# EAGLE design Controle_16_reles V3 (EAGLE 4.09)
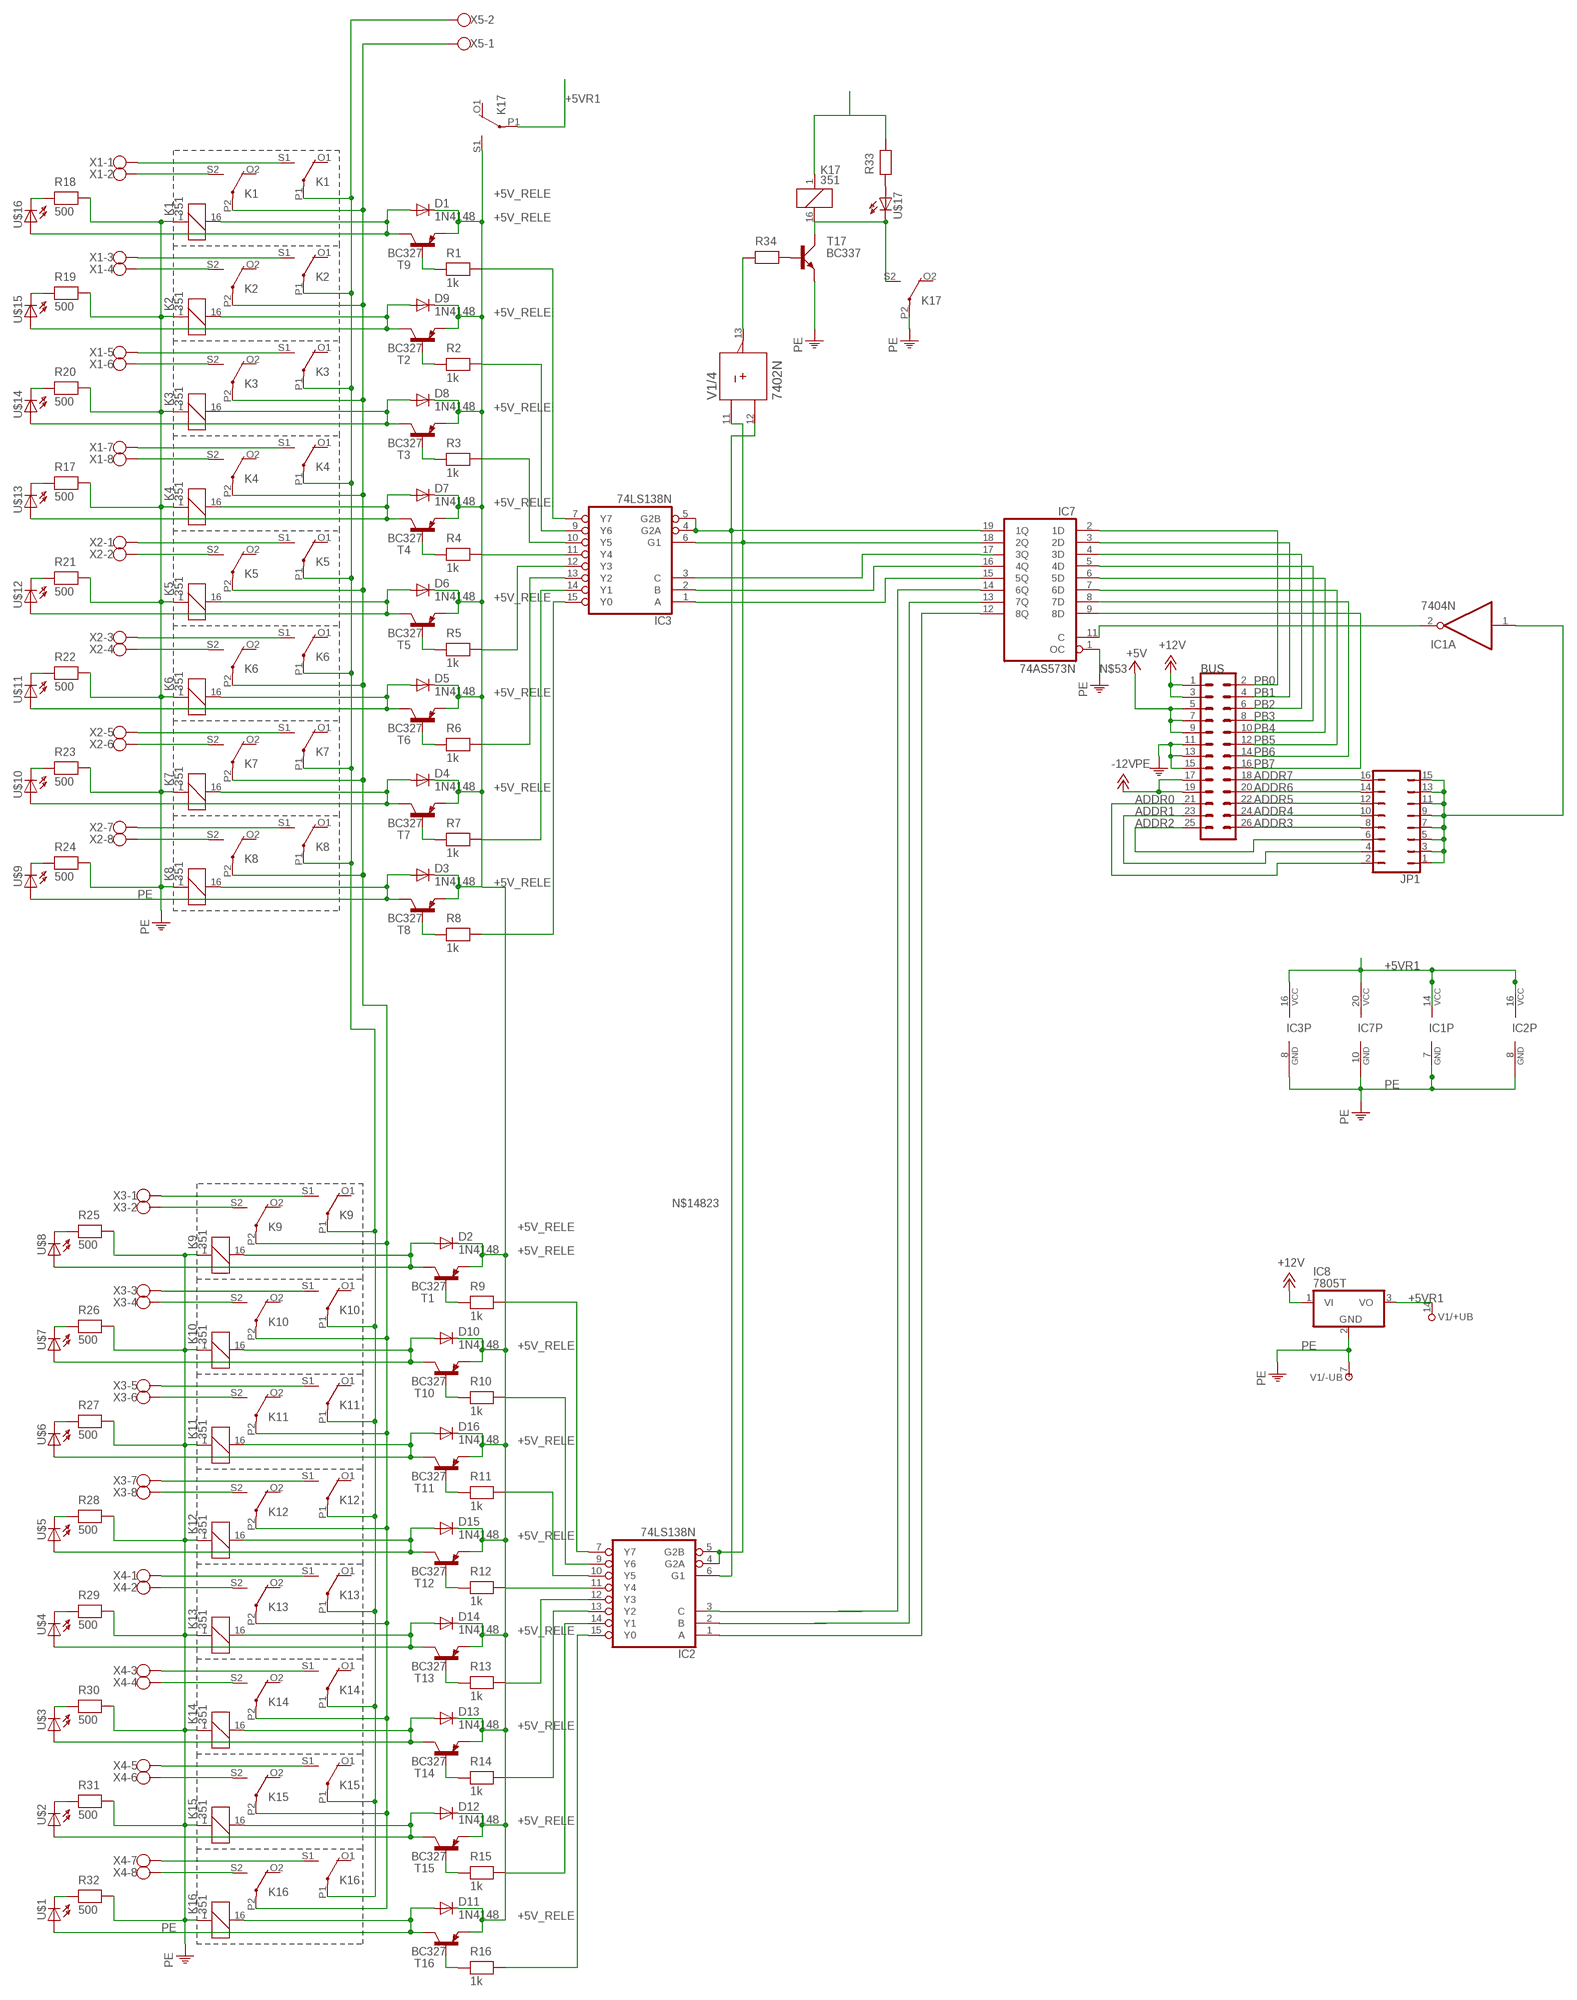
[diagram p0: schematic, sheet 1]

## Parts
BUS  ML26  [ML26]
D1  1N4148  [DO35-10]
D2  1N4148  [DO35-10]
D3  1N4148  [DO35-10]
D4  1N4148  [DO35-10]
D5  1N4148  [DO35-10]
D6  1N4148  [DO35-10]
D7  1N4148  [DO35-10]
D8  1N4148  [DO35-10]
D9  1N4148  [DO35-10]
D10  1N4148  [DO35-10]
D11  1N4148  [DO35-10]
D12  1N4148  [DO35-10]
D13  1N4148  [DO35-10]
D14  1N4148  [DO35-10]
D15  1N4148  [DO35-10]
D16  1N4148  [DO35-10]
IC1  7404N  [DIL14]
IC2  74LS138N  [DIL16]
IC3  74LS138N  [DIL16]
IC7  74AS573N  [DIL20]
IC8  7805T  [TO220H]
JP1  JP8Q  [JP8Q]
K1  351  [351]
K2  351  [351]
K3  351  [351]
K4  351  [351]
K5  351  [351]
K6  351  [351]
K7  351  [351]
K8  351  [351]
K9  351  [351]
K10  351  [351]
K11  351  [351]
K12  351  [351]
K13  351  [351]
K14  351  [351]
K15  351  [351]
K16  351  [351]
K17  351  [351]
R1  1k  RESEU-10  [R-10]
R2  1k  RESEU-10  [R-10]
R3  1k  RESEU-10  [R-10]
R4  1k  RESEU-10  [R-10]
R5  1k  RESEU-10  [R-10]
R6  1k  RESEU-10  [R-10]
R7  1k  RESEU-10  [R-10]
R8  1k  RESEU-10  [R-10]
R9  1k  RESEU-10  [R-10]
R10  1k  RESEU-10  [R-10]
R11  1k  RESEU-10  [R-10]
R12  1k  RESEU-10  [R-10]
R13  1k  RESEU-10  [R-10]
R14  1k  RESEU-10  [R-10]
R15  1k  RESEU-10  [R-10]
R16  1k  RESEU-10  [R-10]
R17  500  RESEU-10  [R-10]
R18  500  RESEU-10  [R-10]
R19  500  RESEU-10  [R-10]
R20  500  RESEU-10  [R-10]
R21  500  RESEU-10  [R-10]
R22  500  RESEU-10  [R-10]
R23  500  RESEU-10  [R-10]
R24  500  RESEU-10  [R-10]
R25  500  RESEU-10  [R-10]
R26  500  RESEU-10  [R-10]
R27  500  RESEU-10  [R-10]
R28  500  RESEU-10  [R-10]
R29  500  RESEU-10  [R-10]
R30  500  RESEU-10  [R-10]
R31  500  RESEU-10  [R-10]
R32  500  RESEU-10  [R-10]
R33  RESEU-10  [R-10]
R34  RESEU-10  [R-10]
T1  BC327  [TO92]
T2  BC327  [TO92]
T3  BC327  [TO92]
T4  BC327  [TO92]
T5  BC327  [TO92]
T6  BC327  [TO92]
T7  BC327  [TO92]
T8  BC327  [TO92]
T9  BC327  [TO92]
T10  BC327  [TO92]
T11  BC327  [TO92]
T12  BC327  [TO92]
T13  BC327  [TO92]
T14  BC327  [TO92]
T15  BC327  [TO92]
T16  BC327  [TO92]
T17  BC337  [SOT54A]
U$1  LED3MM  [LED3MM]
U$2  LED3MM  [LED3MM]
U$3  LED3MM  [LED3MM]
U$4  LED3MM  [LED3MM]
U$5  LED3MM  [LED3MM]
U$6  LED3MM  [LED3MM]
U$7  LED3MM  [LED3MM]
U$8  LED3MM  [LED3MM]
U$9  LED3MM  [LED3MM]
U$10  LED3MM  [LED3MM]
U$11  LED3MM  [LED3MM]
U$12  LED3MM  [LED3MM]
U$13  LED3MM  [LED3MM]
U$14  LED3MM  [LED3MM]
U$15  LED3MM  [LED3MM]
U$16  LED3MM  [LED3MM]
U$17  LED3MM  [LED3MM]
V1  7402N  [DIL14]
X1  AK500/8  [AK500/8]
X2  AK500/8  [AK500/8]
X3  AK500/8  [AK500/8]
X4  AK500/8  [AK500/8]
X5  AK300/2  [AK300/2]

## Nets
+5V: BUS.5 BUS.7 BUS.9
+5V_RELE: D1.C D2.C D3.C D4.C D5.C D6.C D7.C D8.C D9.C D10.C D11.C D12.C D13.C D14.C D15.C D16.C K17.S1(2:S) T1.1(E) T2.1(E) T3.1(E) T4.1(E) T5.1(E) T6.1(E) T7.1(E) T8.1(E) T9.1(E) T10.1(E) T11.1(E) T12.1(E) T13.1(E) T14.1(E) T15.1(E) T16.1(E)
+5VR1: IC1.14(P:VCC) IC2.16(VCC) IC3.16(VCC) IC7.20(VCC) IC8.3(VO) K17.P1(2:P) V1.14(/+UB:+UB)
+12V: BUS.1 BUS.3 IC8.1(VI)
-12V: BUS.17 BUS.19
ADDR0: BUS.21 JP1.2
ADDR1: BUS.23 JP1.4
ADDR2: BUS.25 JP1.6
ADDR3: BUS.26 JP1.8
ADDR4: BUS.24 JP1.10
ADDR5: BUS.22 JP1.12
ADDR6: BUS.20 JP1.14
ADDR7: BUS.18 JP1.16
GARANTIA1: IC2.6(G1) IC3.4(G2A) IC3.5(G2B) IC7.19(1Q) V1.12(/4:B)
GARANTIA2: IC2.4(G2A) IC2.5(G2B) IC3.6(G1) IC7.18(2Q) V1.11(/4:A)
N$1: R9.1 T1.2(B)
N$2: R5.1 T5.2(B)
N$3: IC3.7(Y7) R1.2
N$4: IC3.9(Y6) R2.2
N$5: IC3.10(Y5) R3.2
N$6: IC3.11(Y4) R4.2
N$7: IC3.15(Y0) R8.2
N$8: IC3.14(Y1) R7.2
N$9: IC3.13(Y2) R6.2
N$10: R1.1 T9.2(B)
N$11: IC3.3(C) IC7.17(3Q)
N$12: IC3.2(B) IC7.16(4Q)
N$13: R34.2 T17.B
N$15: D6.A K5.16 T5.3(C) U$12.A
N$16: K17.16 K17.S2(3:S) T17.C U$17.K(C)
N$17: R2.1 T2.2(B)
N$18: D1.A K1.16 T9.3(C) U$16.A
N$19: D9.A K2.16 T2.3(C) U$15.A
N$20: R6.1 T6.2(B)
N$21: R3.1 T3.2(B)
N$22: D8.A K3.16 T3.3(C) U$14.A
N$23: D5.A K6.16 T6.3(C) U$11.A
N$24: R4.1 T4.2(B)
N$25: D7.A K4.16 T4.3(C) U$13.A
N$26: R7.1 T7.2(B)
N$27: D4.A K7.16 T7.3(C) U$10.A
N$28: R8.1 T8.2(B)
N$29: D3.A K8.16 T8.3(C) U$9.A
N$30: IC3.12(Y3) R5.2
N$32: R34.1 V1.13(/4:Y)
N$33: IC1.1(A:I) JP1.1 JP1.3 JP1.5 JP1.7 JP1.9 JP1.11 JP1.13 JP1.15
N$34: IC3.1(A) IC7.15(5Q)
N$35: K1.S1(2:S) X1.1
N$36: K1.S2(3:S) X1.2
N$37: K2.S1(2:S) X1.3
N$38: K2.S2(3:S) X1.4
N$39: K3.S1(2:S) X1.5
N$40: K3.S2(3:S) X1.6
N$41: K4.S1(2:S) X1.7
N$42: K4.S2(3:S) X1.8
N$43: K5.S1(2:S) X2.1
N$44: K5.S2(3:S) X2.2
N$45: K6.S1(2:S) X2.3
N$46: K6.S2(3:S) X2.4
N$47: K7.S1(2:S) X2.5
N$48: K7.S2(3:S) X2.6
N$49: K8.S1(2:S) X2.7
N$50: K8.S2(3:S) X2.8
N$51: R18.1 U$16.K(C)
N$52: D2.A K9.16 T1.3(C) U$8.A
N$53: IC1.2(A:O) IC7.11(C)
N$54: R10.1 T10.2(B)
N$55: D10.A K10.16 T10.3(C) U$7.A
N$56: R11.1 T11.2(B)
N$57: D16.A K11.16 T11.3(C) U$6.A
N$58: R12.1 T12.2(B)
N$60: D15.A K12.16 T12.3(C) U$5.A
N$61: R13.1 T13.2(B)
N$62: D14.A K13.16 T13.3(C) U$4.A
N$63: R14.1 T14.2(B)
N$64: D13.A K14.16 T14.3(C) U$3.A
N$65: R15.1 T15.2(B)
N$66: D12.A K15.16 T15.3(C) U$2.A
N$67: R16.1 T16.2(B)
N$68: D11.A K16.16 T16.3(C) U$1.A
N$69: IC2.7(Y7) R9.2
N$70: IC2.9(Y6) R10.2
N$71: IC2.10(Y5) R11.2
N$72: IC2.11(Y4) R12.2
N$73: IC2.15(Y0) R16.2
N$74: IC2.14(Y1) R15.2
N$75: IC2.13(Y2) R14.2
N$76: IC2.12(Y3) R13.2
N$77: IC2.2(B) IC7.13(7Q)
N$78: K9.S1(2:S) X3.1
N$79: K9.S2(3:S) X3.2
N$80: K10.S1(2:S) X3.3
N$81: K10.S2(3:S) X3.4
N$82: K11.S1(2:S) X3.5
N$83: K11.S2(3:S) X3.6
N$84: K12.S1(2:S) X3.7
N$85: K12.S2(3:S) X3.8
N$86: K13.S1(2:S) X4.1
N$87: K13.S2(3:S) X4.2
N$88: K14.S1(2:S) X4.3
N$89: K14.S2(3:S) X4.4
N$90: K15.S1(2:S) X4.5
N$91: K15.S2(3:S) X4.6
N$92: K16.S1(2:S) X4.7
N$93: K16.S2(3:S) X4.8
N$94: R20.1 U$14.K(C)
N$95: R19.1 U$15.K(C)
N$96: R32.1 U$1.K(C)
N$98: R17.1 U$13.K(C)
N$108: K17.1 R33.2
N$112: R33.1 U$17.A
N$114: IC2.3(C) IC7.14(6Q)
N$118: IC2.1(A) IC7.12(8Q)
N$148: K1.P1(2:P) K2.P1(2:P) K3.P1(2:P) K4.P1(2:P) K5.P1(2:P) K6.P1(2:P) K7.P1(2:P) K8.P1(2:P) K9.P1(2:P) K10.P1(2:P) K11.P1(2:P) K12.P1(2:P) K13.P1(2:P) K14.P1(2:P) K15.P1(2:P) K16.P1(2:P) X5.2
N$150: R21.1 U$12.K(C)
N$153: R22.1 U$11.K(C)
N$156: R23.1 U$10.K(C)
N$160: R24.1 U$9.K(C)
N$163: R25.1 U$8.K(C)
N$165: R26.1 U$7.K(C)
N$169: R27.1 U$6.K(C)
N$171: R28.1 U$5.K(C)
N$174: R29.1 U$4.K(C)
N$177: R30.1 U$3.K(C)
N$180: R31.1 U$2.K(C)
N$14823: K1.P2(3:P) K2.P2(3:P) K3.P2(3:P) K4.P2(3:P) K5.P2(3:P) K6.P2(3:P) K7.P2(3:P) K8.P2(3:P) K9.P2(3:P) K10.P2(3:P) K11.P2(3:P) K12.P2(3:P) K13.P2(3:P) K14.P2(3:P) K15.P2(3:P) K16.P2(3:P) X5.1
PB0: BUS.2 IC7.2(1D)
PB1: BUS.4 IC7.3(2D)
PB2: BUS.6 IC7.4(3D)
PB3: BUS.8 IC7.5(4D)
PB4: BUS.10 IC7.6(5D)
PB5: BUS.12 IC7.7(6D)
PB6: BUS.14 IC7.8(7D)
PB7: BUS.16 IC7.9(8D)
PE: BUS.11 BUS.13 BUS.15 IC1.7(P:GND) IC2.8(GND) IC3.8(GND) IC7.1(OC) IC7.10(GND) IC8.2(GND) K1.1 K2.1 K3.1 K4.1 K5.1 K6.1 K7.1 K8.1 K9.1 K10.1 K11.1 K12.1 K13.1 K14.1 K15.1 K16.1 K17.P2(3:P) R17.2 R18.2 R19.2 R20.2 R21.2 R22.2 R23.2 R24.2 R25.2 R26.2 R27.2 R28.2 R29.2 R30.2 R31.2 R32.2 T17.E V1.7(/-UB:-UB)
Unconnected: IC1.3(B:I) IC1.4(B:O) IC1.5(C:I) IC1.6(C:O) IC1.8(D:O) IC1.9(D:I) IC1.10(E:O) IC1.11(E:I) IC1.12(F:O) IC1.13(F:I) K1.O1(2:O) K1.O2(3:O) K2.O1(2:O) K2.O2(3:O) K3.O1(2:O) K3.O2(3:O) K4.O1(2:O) K4.O2(3:O) K5.O1(2:O) K5.O2(3:O) K6.O1(2:O) K6.O2(3:O) K7.O1(2:O) K7.O2(3:O) K8.O1(2:O) K8.O2(3:O) K9.O1(2:O) K9.O2(3:O) K10.O1(2:O) K10.O2(3:O) K11.O1(2:O) K11.O2(3:O) K12.O1(2:O) K12.O2(3:O) K13.O1(2:O) K13.O2(3:O) K14.O1(2:O) K14.O2(3:O) K15.O1(2:O) K15.O2(3:O) K16.O1(2:O) K16.O2(3:O) K17.O1(2:O) K17.O2(3:O) V1.1(/1:Y) V1.2(/1:A) V1.3(/1:B) V1.4(/2:Y) V1.5(/2:A) V1.6(/2:B) V1.8(/3:A) V1.9(/3:B) V1.10(/3:Y)

## Library data of the parts
BUS = con-harting-ml:ML26: HARTING
D1-D16 = diode:1N4148: DIODE high speed (Philips)
IC1 = 74xx-us:74*04: Hex INVERTER
IC2 IC3 = 74xx-us:74*138: 3-line to 8-line DECODER/DEMULTIPLEXER
IC7 = 74xx-us:74*573: 8-bit D latch BUS DRIVER
IC8 = linear:78*: Positive VOLTAGE REGULATOR
JP1 = jumper:JP8Q: JUMPER
K1-K17 = relay:351: RELAY 2 x switch, Omron
R1-R34 = discrete:RESEU-10
T1-T16 = transistor-pnp:BC327: PNP Transistor
T17 = transistor-small-signal:BC337: NPN TRANSISTOR
U$1-U$17 = led:LED: LED
V1 = 74ttl-din:74*02: Quad 2-input NOR gate
X1-X4 = con-ptr500:AK500/8: CONNECTOR
X5 = con-ptr500:AK300/2: CONNECTOR

## Board
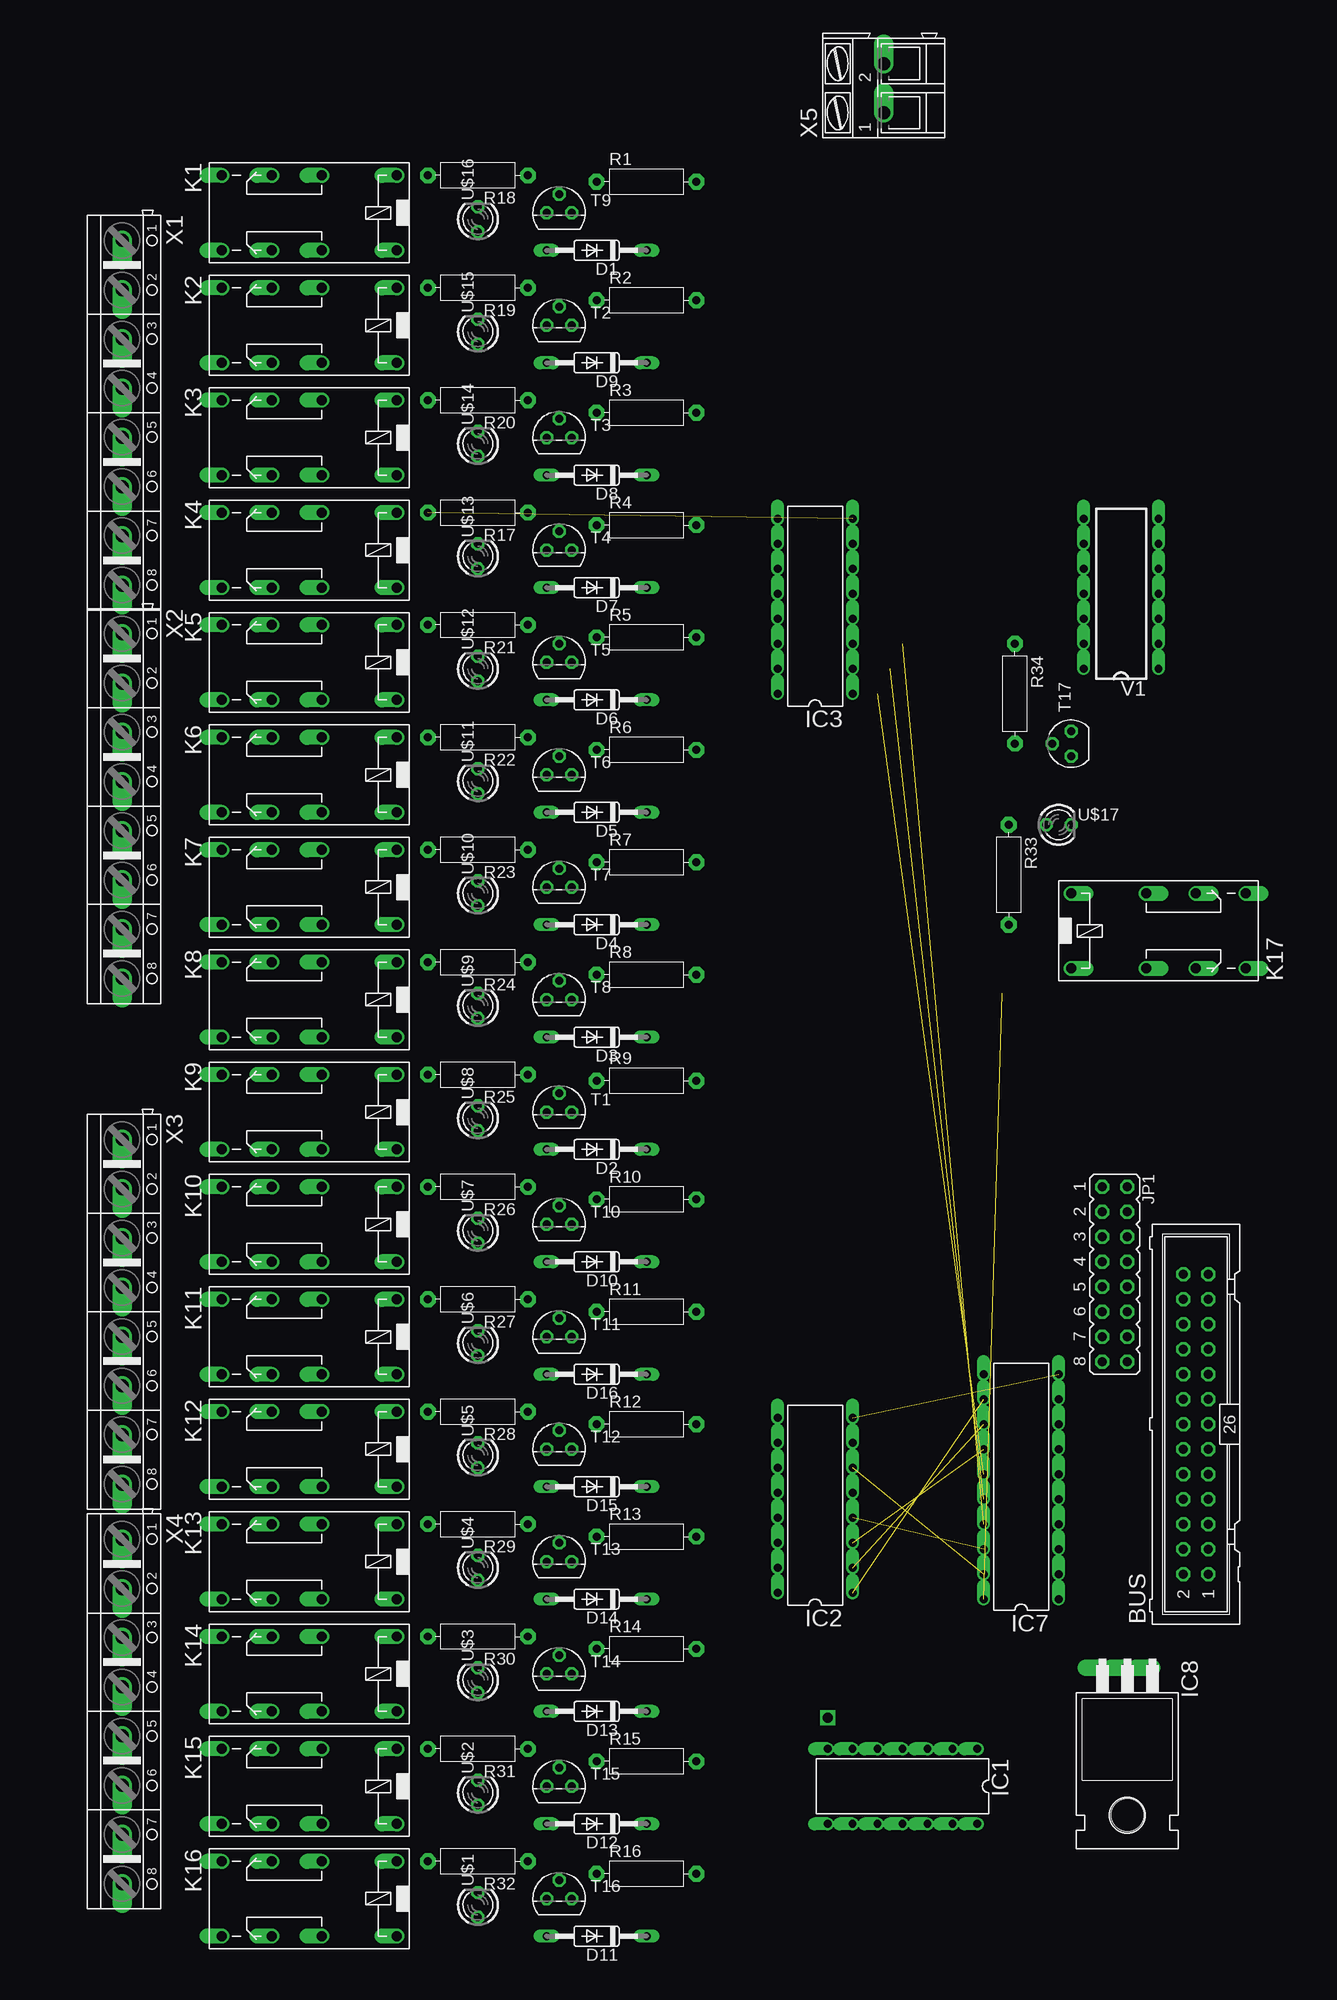
[diagram p1: board, top side]
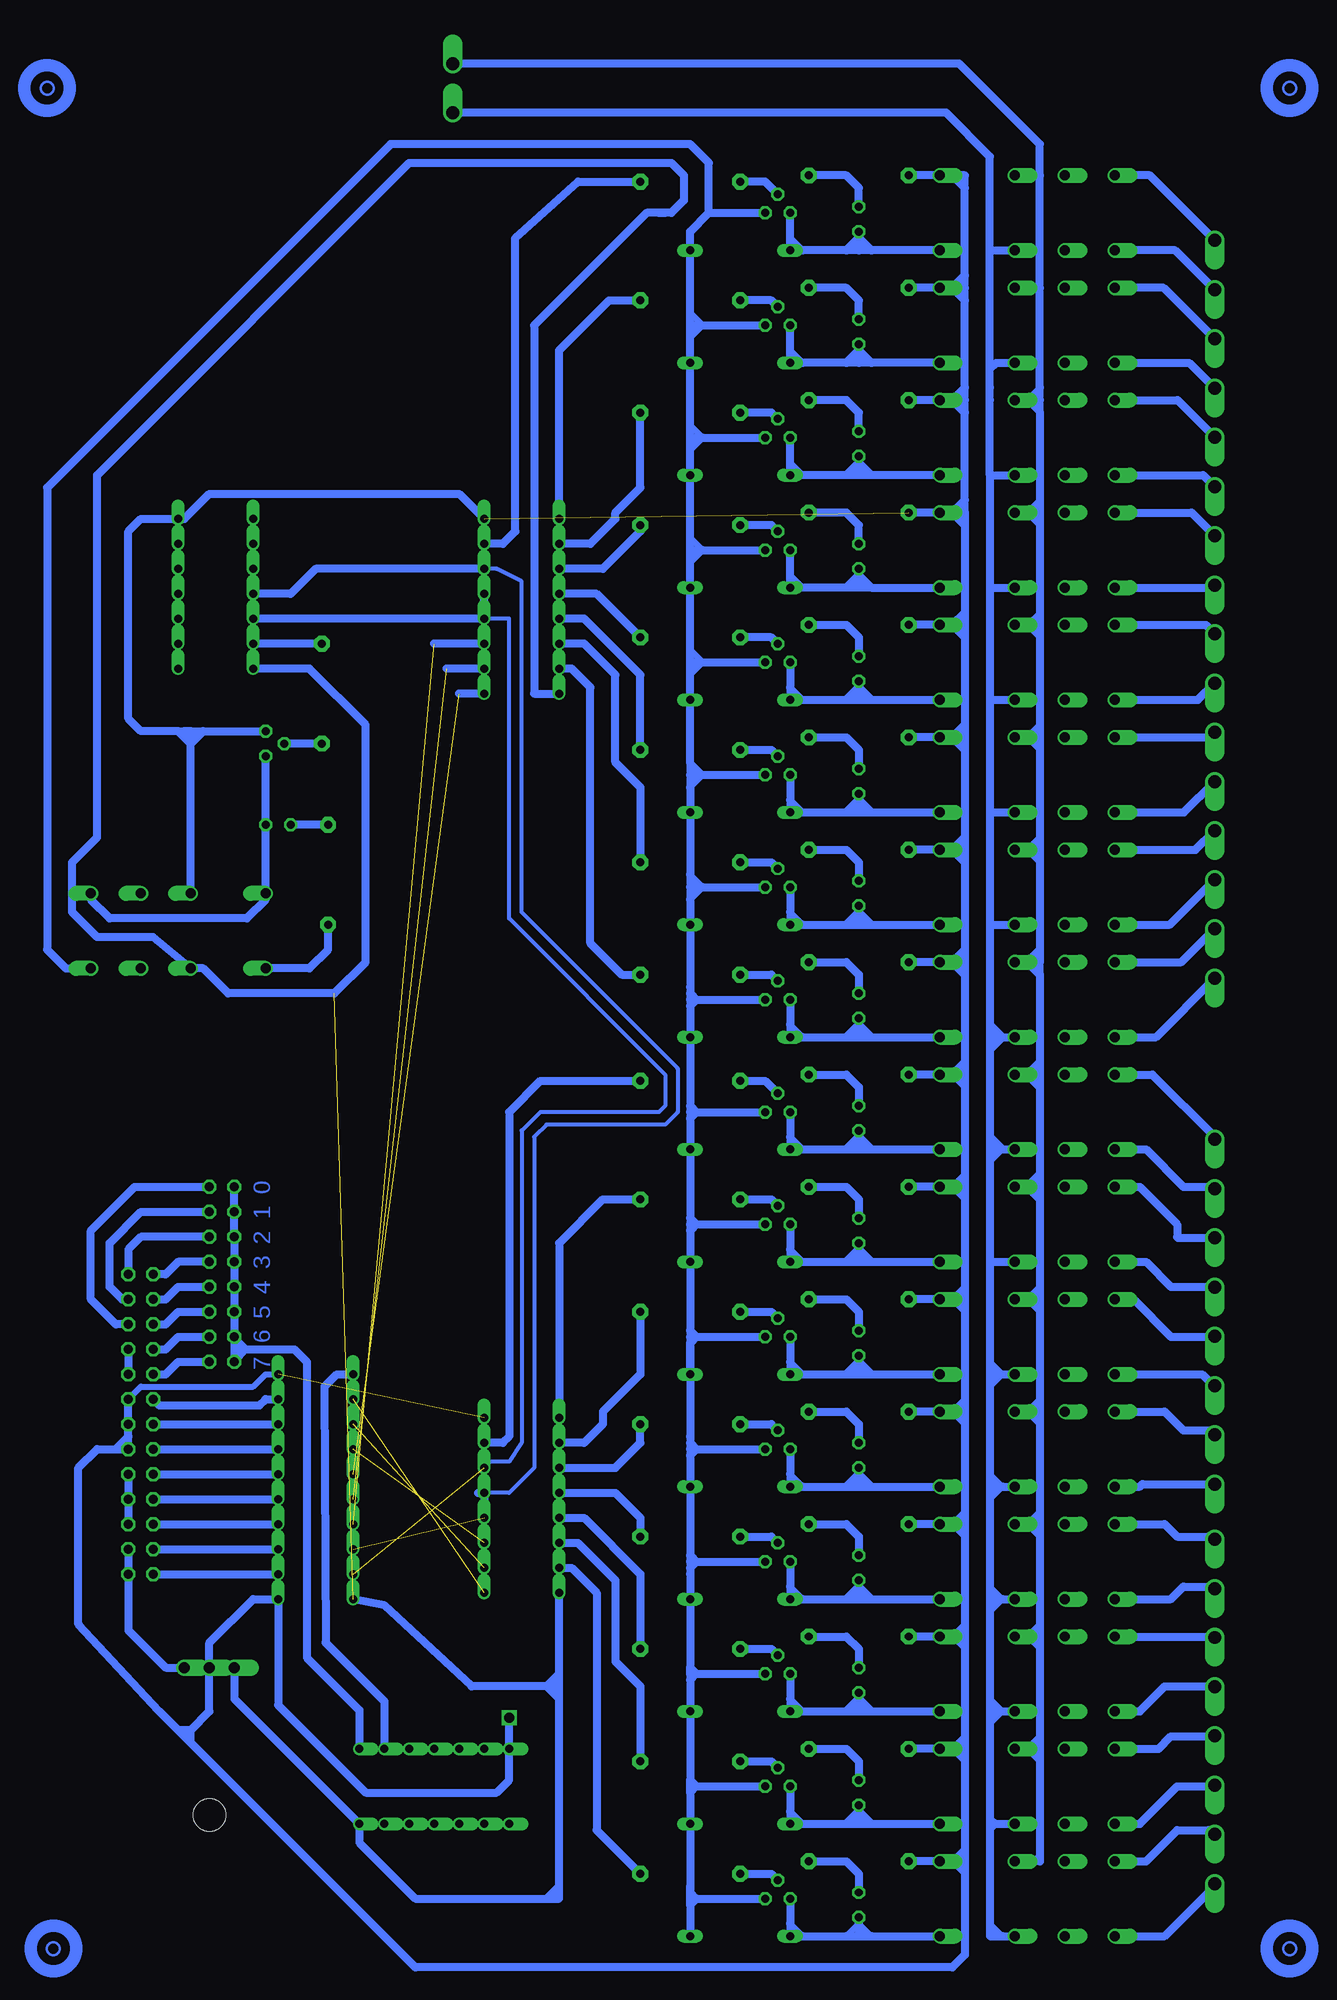
[diagram p2: board, bottom side, seen from below]

No outline drawn. Coordinates in mm, seen from the top.
Copper layers used: Bottom

### Footprints (pad centres in the part's own frame; a part is rotated, then mirrored left to right if it is on the bottom)
ML26 = drill 0.914 octagon: 1 -15.24,-1.27; 2 -15.24,1.27; 3 -12.7,-1.27; 4 -12.7,1.27; 5 -10.16,-1.27; 6 -10.16,1.27; 7 -7.62,-1.27; 8 -7.62,1.27; 9 -5.08,-1.27; 10 -5.08,1.27; 11 -2.54,-1.27; 12 -2.54,1.27; 13 0,-1.27; 14 0,1.27; 15 2.54,-1.27; 16 2.54,1.27; 17 5.08,-1.27; 18 5.08,1.27; 19 7.62,-1.27; 20 7.62,1.27; 21 10.16,-1.27; 22 10.16,1.27; 23 12.7,-1.27; 24 12.7,1.27; 25 15.24,-1.27; 26 15.24,1.27
DO35-10 = drill 0.813 long: A 5.08,0; C -5.08,0
DIL14 = drill 0.8 offset: 1 -7.62,-3.81; 2 -5.08,-3.81; 3 -2.54,-3.81; 4 0,-3.81; 5 2.54,-3.81; 6 5.08,-3.81; 7 7.62,-3.81; 8 7.62,3.81; 9 5.08,3.81; 10 2.54,3.81; 11 0,3.81; 12 -2.54,3.81; 13 -5.08,3.81; 14 -7.62,3.81
DIL16 = drill 0.813 offset: 1 -8.89,-3.81; 2 -6.35,-3.81; 3 -3.81,-3.81; 4 -1.27,-3.81; 5 1.27,-3.81; 6 3.81,-3.81; 7 6.35,-3.81; 8 8.89,-3.81; 9 8.89,3.81; 10 6.35,3.81; 11 3.81,3.81; 12 1.27,3.81; 13 -1.27,3.81; 14 -3.81,3.81; 15 -6.35,3.81; 16 -8.89,3.81
DIL20 = drill 0.813 offset: 1 -11.43,-3.81; 2 -8.89,-3.81; 3 -6.35,-3.81; 4 -3.81,-3.81; 5 -1.27,-3.81; 6 1.27,-3.81; 7 3.81,-3.81; 8 6.35,-3.81; 9 8.89,-3.81; 10 11.43,-3.81; 11 11.43,3.81; 12 8.89,3.81; 13 6.35,3.81; 14 3.81,3.81; 15 1.27,3.81; 16 -1.27,3.81; 17 -3.81,3.81; 18 -6.35,3.81; 19 -8.89,3.81; 20 -11.43,3.81
TO220H = drill 1.118 offset: 1 -2.54,-10.16; 2 0,-10.16; 3 2.54,-10.16 | hole 3.302: 0,4.826
JP8Q = drill 0.914 octagon: 1 -8.89,-1.27; 2 -8.89,1.27; 3 -6.35,-1.27; 4 -6.35,1.27; 5 -3.81,-1.27; 6 -3.81,1.27; 7 -1.27,-1.27; 8 -1.27,1.27; 9 1.27,-1.27; 10 1.27,1.27; 11 3.81,-1.27; 12 3.81,1.27; 13 6.35,-1.27; 14 6.35,1.27; 15 8.89,-1.27; 16 8.89,1.27
351 = drill 1.016 offset: 1 -3.81,-3.81; 16 -3.81,3.81; O1 8.89,-3.81; O2 8.89,3.81; P1 3.81,-3.81; P2 3.81,3.81; S1 13.97,-3.81; S2 13.97,3.81
R-10 = drill 0.813 pad 1.6 octagon: 1 -5.08,0; 2 5.08,0
TO92 = drill 0.813 octagon: 1 1.27,0; 2 0,1.905; 3 -1.27,0
SOT54A = drill 0.813 octagon: B 0,1.905; C -1.27,0; E 1.27,0
LED3MM = drill 0.813 octagon: A -1.27,0; K 1.27,0
DIL14' = drill 0.813 offset: 1 -7.62,-3.81; 2 -5.08,-3.81; 3 -2.54,-3.81; 4 0,-3.81; 5 2.54,-3.81; 6 5.08,-3.81; 7 7.62,-3.81; 8 7.62,3.81; 9 5.08,3.81; 10 2.54,3.81; 11 0,3.81; 12 -2.54,3.81; 13 -5.08,3.81; 14 -7.62,3.81
AK500/8 = drill 1.321 offset: 1 -17.526,0; 2 -12.497,0; 3 -7.518,0; 4 -2.489,0; 5 2.489,0; 6 7.518,0; 7 12.497,0; 8 17.526,0
AK300/2 = drill 1.321 offset: 1 -2.515,0; 2 2.489,0

### Placement (x,y rotation side)
BUS  40.01,-51.44 90 top
D1  -20.95,67.94 180 top
D2  -20.95,-23.5 180 top
D3  -20.95,-12.06 180 top
D4  -20.95,-0.64 180 top
D5  -20.95,10.79 180 top
D6  -20.95,22.23 180 top
D7  -20.95,33.66 180 top
D8  -20.95,45.09 180 top
D9  -20.95,56.52 180 top
D10  -20.95,-34.92 180 top
D11  -20.95,-103.5 180 top
D12  -20.95,-92.08 180 top
D13  -20.95,-80.64 180 top
D14  -20.95,-69.22 180 top
D15  -20.95,-57.78 180 top
D16  -20.95,-46.35 180 top
IC1  10.16,-88.27 180 top
IC2  1.27,-59.69 90 top
IC3  1.27,31.75 90 top
IC7  22.23,-57.78 90 top
IC8  33.02,-86.36 180 top
JP1  31.75,-36.2 270 top
K1  -45.09,71.75 180 top
K2  -45.09,60.33 180 top
K3  -45.09,48.9 180 top
K4  -45.09,37.47 180 top
K5  -45.09,26.04 180 top
K6  -45.09,14.61 180 top
K7  -45.09,3.17 180 top
K8  -45.09,-8.26 180 top
K9  -45.09,-19.68 180 top
K10  -45.09,-31.11 180 top
K11  -45.09,-42.55 180 top
K12  -45.09,-53.98 180 top
K13  -45.09,-65.41 180 top
K14  -45.09,-76.83 180 top
K15  -45.09,-88.27 180 top
K16  -45.09,-99.69 180 top
K17  31.11,-1.27 0 top
R1  -15.88,74.93 0 top
R2  -15.88,62.87 0 top
R3  -15.88,51.44 0 top
R4  -15.88,40.01 0 top
R5  -15.88,28.57 0 top
R6  -15.88,17.14 0 top
R7  -15.88,5.71 0 top
R8  -15.88,-5.71 0 top
R9  -15.88,-16.51 0 top
R10  -15.88,-28.57 0 top
R11  -15.88,-40.01 0 top
R12  -15.88,-51.44 0 top
R13  -15.88,-62.87 0 top
R14  -15.88,-74.3 0 top
R15  -15.88,-85.72 0 top
R16  -15.88,-97.16 0 top
R17  -33.02,41.27 180 top
R18  -33.02,75.56 180 top
R19  -33.02,64.14 180 top
R20  -33.02,52.7 180 top
R21  -33.02,29.84 180 top
R22  -33.02,18.41 180 top
R23  -33.02,6.99 180 top
R24  -33.02,-4.45 180 top
R25  -33.02,-15.88 180 top
R26  -33.02,-27.3 180 top
R27  -33.02,-38.73 180 top
R28  -33.02,-50.16 180 top
R29  -33.02,-61.59 180 top
R30  -33.02,-73.03 180 top
R31  -33.02,-84.45 180 top
R32  -33.02,-95.89 180 top
R33  20.95,4.45 270 top
R34  21.59,22.86 270 top
T1  -24.77,-19.68 0 top
T2  -24.77,60.33 0 top
T3  -24.77,48.9 0 top
T4  -24.77,37.47 0 top
T5  -24.77,26.04 0 top
T6  -24.77,14.61 0 top
T7  -24.77,3.17 0 top
T8  -24.77,-8.26 0 top
T9  -24.77,71.75 0 top
T10  -24.77,-31.11 0 top
T11  -24.77,-42.55 0 top
T12  -24.77,-53.98 0 top
T13  -24.77,-65.41 0 top
T14  -24.77,-76.83 0 top
T15  -24.77,-88.27 0 top
T16  -24.77,-99.69 0 top
T17  27.3,17.78 90 top
U$1  -33.02,-100.33 90 top
U$2  -33.02,-88.9 90 top
U$3  -33.02,-77.47 90 top
U$4  -33.02,-66.04 90 top
U$5  -33.02,-54.61 90 top
U$6  -33.02,-43.18 90 top
U$7  -33.02,-31.75 90 top
U$8  -33.02,-20.32 90 top
U$9  -33.02,-8.89 90 top
U$10  -33.02,2.54 90 top
U$11  -33.02,13.97 90 top
U$12  -33.02,25.4 90 top
U$13  -33.02,36.83 90 top
U$14  -33.02,48.26 90 top
U$15  -33.02,59.69 90 top
U$16  -33.02,71.12 90 top
U$17  26.04,9.53 0 top
V1  7402N  [DIL14']  32.38,33.02 90 top
X1  -69.22,51.44 270 top
X2  -69.22,11.43 270 top
X3  -69.22,-40.01 270 top
X4  -69.22,-80.64 270 top
X5  8.26,84.45 90 top

### Tracks (layer width: path | path; a pad name or v marks a point on that pad's centre or on a via)
+5V
  Bottom 0.813: BUS.5 BUS.7 BUS.9
+5V_RELE
  Bottom 0.61: -15.88,13.34 -17.14,14.61 -15.88,15.88 | -15.88,27.3 -17.14,26.04 -15.88,24.77 | -15.88,38.73 -17.14,37.47 -15.88,36.2 | -15.88,50.16 -17.14,48.9 -15.88,47.62 | -15.88,61.59 -17.14,60.33 -15.88,59.05 | -15.88,4.45 -17.14,3.17 -15.88,1.91
  Bottom 0.813: D4.C -15.88,1.91 -15.88,3.17 | -15.88,3.17 -17.14,3.17 T7.1 -15.88,3.17 | -15.88,14.61 -15.88,13.34 D5.C -15.88,4.45 -15.88,3.17 | -15.88,14.61 -17.14,14.61 T6.1 | -15.88,26.04 -15.88,24.77 D6.C -15.88,15.88 -15.88,14.61 | -15.88,26.04 -17.14,26.04 T5.1 | -15.88,37.47 -15.88,36.2 D7.C -15.88,27.3 -15.88,26.04 | -15.88,37.47 -17.14,37.47 T4.1 | -15.88,48.9 -15.88,47.62 D8.C -15.88,38.73 -15.88,37.47 | -15.88,48.9 -17.14,48.9 T3.1 | -15.88,60.33 -15.88,59.05 D9.C -15.88,50.16 -15.88,48.9 | -15.88,60.33 -17.14,60.33 T2.1 | -15.88,60.33 -15.88,61.59 D1.C -15.88,69.85 -17.78,71.75 | -15.88,3.17 D4.C | D4.C -15.88,-6.99 | -15.88,-8.26 -15.88,-8.89 | -15.88,-8.89 D3.C -15.88,-19.05 | -15.88,-19.68 -15.88,-20.32 | -15.88,-20.32 D2.C -15.88,-30.48 | -15.88,-31.11 -15.88,-31.75 | -16.51,-8.26 T8.1 | -15.88,-8.26 -16.51,-8.26 | -15.88,-6.99 -15.88,-8.26 | -15.88,-6.99 -15.88,-7.62 -16.51,-8.26 | -16.51,-8.26 -15.88,-8.89 | -15.88,-8.89 -15.88,-19.05 | -16.51,-19.68 T1.1 | -15.88,-19.68 -16.51,-19.68 | -15.88,-19.05 -15.88,-19.68 | -15.88,-19.05 -16.51,-19.68 | -16.51,-19.68 -15.88,-20.32 | -16.51,-31.11 T10.1 | -15.88,-31.11 -16.51,-31.11 | -15.88,-30.48 -15.88,-31.11 | -15.88,-30.48 -16.51,-31.11 | -16.51,-31.11 -15.88,-31.75 | -15.88,-31.75 D10.C -15.88,-41.91 | -15.88,-41.91 -15.88,-42.55 | -15.88,-42.55 -16.51,-42.55 | -16.51,-42.55 T11.1 | D16.C -15.88,-43.81 | -15.88,-42.55 -15.88,-43.81 | -15.88,-43.81 -15.88,-43.18 -16.51,-42.55 | -15.88,-41.91 -16.51,-42.55 | -15.88,-41.91 D16.C | D16.C -15.88,-52.7 | -15.88,-52.7 -15.88,-53.98 | -15.88,-54.61 D15.C -15.88,-64.77 | -15.88,-64.77 -15.88,-65.41 | -15.88,-66.67 D14.C -15.88,-76.2
  Bottom 0.813: -15.88,-77.47 D13.C -15.88,-87.63 | -15.88,-88.9 D12.C -15.88,-98.42 | -15.88,-100.33 D11.C | -15.88,-100.33 -15.88,-99.69 | -16.51,-99.69 T16.1 | -15.88,-99.69 -16.51,-99.69 | -15.88,-99.69 -15.88,-98.42 | -15.88,-98.42 -15.88,-99.06 -16.51,-99.69 | -15.88,-100.33 -16.51,-99.69 | -15.88,-88.9 -15.88,-100.33 | -15.88,-88.9 -15.88,-88.27 | -16.51,-88.27 T15.1 | -15.88,-88.27 -16.51,-88.27 | -15.88,-88.27 -15.88,-87.63 | -16.51,-88.27 -15.88,-87.63 | -15.88,-88.9 -16.51,-88.27 | -15.88,-77.47 -15.88,-88.9 | -16.51,-76.83 T14.1 | -15.88,-76.2 -16.51,-76.83 | -15.88,-76.83 -15.88,-76.2 | -15.88,-76.83 -15.88,-77.47 | -15.88,-77.47 -16.51,-76.83 | -15.88,-76.83 -16.51,-76.83 | -15.88,-66.67 -15.88,-76.83 | -16.51,-65.41 T13.1 | -15.88,-65.41 -16.51,-65.41 | -15.88,-65.41 -15.88,-66.67 | -15.88,-66.67 -15.88,-66.04 -16.51,-65.41 | -15.88,-64.77 -16.51,-65.41 | -15.88,-54.61 -15.88,-64.77 | -15.88,-53.98 -15.88,-54.61 | -15.88,-53.98 -16.51,-53.98 | -16.51,-53.98 T12.1 | -15.88,-54.61 -16.51,-53.98 | -15.88,-52.7 -15.88,-54.61 | -15.88,-52.7 -15.88,-53.34 -16.51,-53.98 | -17.78,71.75 T9.1 | K17.S1 47.62,-5.08 49.53,-3.17 49.53,43.81 14.61,78.74 13.97,78.74 -15.88,78.74 -17.78,76.83 -17.78,71.75
+5VR1  (1 unrouted)
  Bottom 0.813: IC7.20 15.24,-69.85 6.35,-78.11 -1.27,-78.11 | -2.54,-78.11 -1.27,-78.11 | -2.54,-78.11 -2.54,-76.83 | -2.54,-76.83 IC2.16 | -2.54,-98.42 -2.54,-99.69 -1.27,-99.69 | -2.54,-98.42 -2.54,-79.38 | -2.54,-79.38 -2.54,-78.11 | -1.27,-99.69 12.06,-99.69 17.78,-93.98 IC1.14 30.48,-79.38 IC8.3 | -1.27,-99.69 -2.54,-98.42 | -1.27,-78.11 -2.54,-76.83 | -2.54,-79.38 -1.27,-78.11 | V1.14 22.86,25.4 17.14,19.68 17.14,-4.45 20.32,-7.62 31.11,-7.62 33.66,-5.08 K17.P1 38.73,-1.91 44.45,-1.91 46.99,0.64 46.99,5.71 44.45,8.26 44.45,40.64 | IC3.16 0,22.86 0,60.33 -11.43,71.75 -12.7,71.75 | -12.7,71.75 -13.34,71.75 | 44.45,40.64 44.45,41.27 | -12.7,71.75 -13.97,71.75 -15.24,73.03 -15.24,75.56 -13.97,76.83 12.7,76.83 44.45,45.09 44.45,40.64
+12V
  Bottom 0.813: BUS.3 BUS.1 41.27,-72.39 37.47,-76.2 IC8.1
-12V
  Bottom 0.813: BUS.17 41.27,-45.09 BUS.19
ADDR0
  Bottom 0.813: BUS.21 42.55,-41.27 45.09,-38.73 45.09,-31.75 40.64,-27.3 JP1.2
ADDR1
  Bottom 0.813: BUS.23 41.91,-38.73 43.18,-37.47 43.18,-33.02 40.01,-29.84 JP1.4
ADDR2
  Bottom 0.813: 41.27,-35.56 BUS.25 41.27,-33.66 40.01,-32.38 JP1.6
ADDR3
  Bottom 0.813: BUS.26 37.47,-36.2 36.2,-34.92 JP1.8
ADDR4
  Bottom 0.813: BUS.24 37.47,-38.73 36.2,-37.47 JP1.10
ADDR5
  Bottom 0.813: BUS.22 37.47,-41.27 36.2,-40.01 JP1.12
ADDR6
  Bottom 0.813: BUS.20 37.47,-43.81 36.2,-42.55 JP1.14
ADDR7
  Bottom 0.813: BUS.18 37.47,-46.35 36.2,-45.09 JP1.16
GARANTIA1  (1 unrouted)
  Bottom 0.406: IC3.4 2.54,30.48 2.54,0 -13.34,-15.88 -13.34,-19.05 -12.7,-19.68 -0.64,-19.68 1.27,-21.59 1.27,-53.34 2.54,-55.24 4.45,-55.24 IC2.6
  Bottom 0.813: V1.12 IC3.4 IC3.5
GARANTIA2  (1 unrouted)
  Bottom 0.406: IC3.6 3.81,35.56 1.27,34.29 1.27,0.64 -14.61,-15.24 -14.61,-19.68 -13.34,-20.95 -1.27,-20.95 0,-22.23 0,-55.88 2.54,-58.42 IC2.5
  Bottom 0.813: IC3.6 22.23,35.56 24.77,33.02 V1.11 | 5.71,-58.42 IC2.5 IC2.4
N$1
  Bottom 0.813: T1.2 -23.5,-16.51 R9.1
N$2
  Bottom 0.813: R5.1 -24.13,28.57 T5.2
N$3
  Bottom 0.813: R1.2 -4.45,74.93 1.91,69.22 1.91,39.37 3.17,38.1 IC3.7
N$4
  Bottom 0.813: R2.2 -7.62,62.87 -2.54,57.78 IC3.9
N$5
  Bottom 0.813: IC3.10 -5.71,38.1 -8.26,40.64 -8.26,41.27 -10.79,43.81 R3.2
N$6
  Bottom 0.813: R4.2 -10.79,39.37 -6.99,35.56 IC3.11
N$7
  Bottom 0.813: IC3.15 -3.81,25.4 -5.71,23.5 -5.71,-2.54 -8.89,-5.71 R8.2
N$8
  Bottom 0.813: R7.2 -10.79,13.34 -8.26,15.88 -8.26,24.77 -5.08,27.94 IC3.14
N$9
  Bottom 0.813: R6.2 -10.79,24.77 -5.08,30.48 IC3.13
N$10
  Bottom 0.813: R1.1 -23.5,74.93 T9.2
N$11  (1 unrouted)
  Bottom 0.813: IC3.3 10.16,27.94
N$12  (1 unrouted)
  Bottom 0.813: IC3.2 8.89,25.4
N$13
  Bottom 0.813: R34.2 T17.B
N$15
  Bottom 0.61: -26.04,23.5 -27.3,22.23
  Bottom 0.813: T5.3 -26.04,23.5 D6.A -27.3,22.23 -31.75,22.23 | -31.75,22.23 -33.02,22.23 | -33.02,22.23 -34.29,22.23 | -34.29,22.23 K5.16 | -33.02,23.5 U$12.A | -33.02,22.23 -33.02,23.5 | -31.75,22.23 -33.02,23.5 | -33.02,23.5 -34.29,22.23
N$16
  Bottom 0.813: T17.C U$17.K K17.16 27.3,1.91 29.21,0 43.18,0 45.09,1.91 K17.S2
N$17
  Bottom 0.813: R2.1 -24.13,62.87 T2.2
N$18
  Bottom 0.61: -27.3,67.94 -26.04,69.22
  Bottom 0.813: T9.3 -26.04,69.22 D1.A -27.3,67.94 -31.75,67.94 | K1.16 -34.29,67.94 | -34.29,67.94 -33.02,67.94 | -33.02,67.94 -31.75,67.94 | -33.02,69.22 U$16.A | -33.02,67.94 -33.02,69.22 | -33.02,69.22 -31.75,67.94 | -34.29,67.94 -33.02,69.22
N$19
  Bottom 0.61: -27.3,56.52 -26.04,57.78
  Bottom 0.813: T2.3 -26.04,57.78 D9.A -27.3,56.52 -31.75,56.52 | K2.16 -34.29,56.52 | -34.29,56.52 -33.02,56.52 | -33.02,56.52 -31.75,56.52 | -33.02,57.78 U$15.A | -33.02,56.52 -33.02,57.78 | -33.02,57.78 -31.75,56.52 | -34.29,56.52 -33.02,57.78
N$20
  Bottom 0.813: R6.1 -24.13,17.14 T6.2
N$21
  Bottom 0.813: R3.1 -24.13,51.44 T3.2
N$22
  Bottom 0.61: -27.3,45.09 -26.04,46.35
  Bottom 0.813: T3.3 -26.04,46.35 D8.A -27.3,45.09 -31.75,45.09 | K3.16 -34.29,45.09 | -34.29,45.09 -33.02,45.09 | -33.02,45.09 -31.75,45.09 | -33.02,46.35 U$14.A | -33.02,45.09 -33.02,46.35 | -33.02,46.35 -31.75,45.09 | -34.29,45.09 -33.02,46.35
N$23
  Bottom 0.61: -26.04,12.06 -27.3,10.79
  Bottom 0.813: -31.75,10.79 -27.3,10.79 D5.A -26.04,12.06 T6.3 | -31.75,10.79 -33.02,10.79 | -33.02,10.79 -34.29,10.79 | -34.29,10.79 K6.16 | -33.02,12.06 U$11.A | -33.02,10.79 -33.02,12.06 | -31.75,10.79 -33.02,12.06 | -33.02,12.06 -34.29,10.79
N$24
  Bottom 0.813: R4.1 -24.13,40.01 T4.2
N$25
  Bottom 0.61: -27.3,33.66 -26.04,34.92
  Bottom 0.813: T4.3 -26.04,34.92 D7.A -27.3,33.66 -31.75,33.66 | -34.29,33.66 K4.16 | -34.29,33.66 -33.02,33.66 | -33.02,33.66 -31.75,33.66 | -33.02,34.92 U$13.A | -33.02,33.66 -33.02,34.92 | -33.02,34.92 -31.75,33.66 | -34.29,33.66 -33.02,34.92
N$26
  Bottom 0.813: R7.1 -24.13,5.71 T7.2
N$27
  Bottom 0.61: -26.04,0.64 -27.3,-0.64
  Bottom 0.813: T7.3 -26.04,0.64 D4.A -27.3,-0.64 -31.75,-0.64 | -31.75,-0.64 -33.02,-0.64 | -33.02,-0.64 -34.29,-0.64 | -34.29,-0.64 K7.16 | -33.02,0.64 U$10.A | -33.02,-0.64 -33.02,0.64 | -31.75,-0.64 -33.02,0.64 | -33.02,0.64 -34.29,-0.64
N$28
  Bottom 0.813: R8.1 -24.13,-5.71 T8.2
N$29
  Bottom 0.61: -26.04,-10.79 -27.3,-12.06
  Bottom 0.813: T8.3 -26.04,-10.79 D3.A -27.3,-12.06 -31.75,-12.06 | -31.75,-12.06 -33.02,-12.06 | -33.02,-12.06 -34.29,-12.06 | -34.29,-12.06 K8.16 | -33.02,-10.79 U$9.A | -33.02,-12.06 -33.02,-10.79 | -31.75,-12.06 -33.02,-10.79 | -33.02,-10.79 -34.29,-12.06
N$30
  Bottom 0.813: IC3.12 -6.35,33.02 R5.2
N$32
  Bottom 0.813: R34.1 V1.13
N$33
  Bottom 0.61: 29.84,-44.45 JP1.15 | 29.21,-43.81 29.84,-43.81 | 29.84,-43.81 30.48,-43.81 | 30.48,-43.18 29.84,-43.81 | JP1.13 29.21,-43.81 | 29.21,-43.81 29.84,-44.45 | 29.84,-43.81 29.84,-44.45
  Bottom 0.813: JP1.1 JP1.3 JP1.5 JP1.7 JP1.9 JP1.11 JP1.13 30.48,-43.18 30.48,-43.81 JP1.15 | 29.21,-43.81 24.38,-43.81 23.11,-45.09 23.11,-75.18 17.78,-80.52 IC1.1
N$34  (1 unrouted)
  Bottom 0.813: IC3.1 7.62,22.86
N$35
  Bottom 0.813: X1.1 -62.61,75.56 K1.S1
N$36
  Bottom 0.813: X1.2 -65.2,67.94 K1.S2
N$37
  Bottom 0.813: X1.3 -64.03,64.14 K2.S1
N$38
  Bottom 0.813: X1.4 -66.62,56.52 K2.S2
N$39
  Bottom 0.813: X1.5 -65.46,52.7 K3.S1
N$40
  Bottom 0.813: X1.6 -68.05,45.09 K3.S2
N$41
  Bottom 0.813: X1.7 -66.88,41.27 K4.S1
N$42
  Bottom 0.813: X1.8 -68.96,33.66 K4.S2
N$43
  Bottom 0.813: X2.1 -68.33,29.84 K5.S1
N$44
  Bottom 0.813: X2.2 -67.51,22.23 K5.S2
N$45
  Bottom 0.813: X2.3 -68.68,18.41 K6.S1
N$46
  Bottom 0.813: X2.4 -66.09,10.79 K6.S2
N$47
  Bottom 0.813: X2.5 -67.26,6.99 K7.S1
N$48
  Bottom 0.813: X2.6 -64.67,-0.64 K7.S2
N$49
  Bottom 0.813: X2.7 -65.84,-4.45 K8.S1
N$50
  Bottom 0.813: X2.8 -63.25,-12.06 K8.S2
N$51
  Bottom 0.813: U$16.K -33.02,74.3 -31.75,75.56 R18.1
N$52
  Bottom 0.61: -26.04,-22.23 -27.3,-23.5
  Bottom 0.813: -33.02,-22.23 U$8.A | -33.02,-22.23 -33.02,-23.5 | T1.3 -26.04,-22.23 D2.A -27.3,-23.5 -31.75,-23.5 | -31.75,-23.5 -34.29,-23.5 | -34.29,-23.5 K9.16 | -31.75,-23.5 -33.02,-22.23 | -34.29,-23.5 -33.02,-22.23
N$53
  Bottom 0.813: IC7.11 20.07,-46.35 21.34,-47.62 21.21,-73.66 15.24,-79.63 IC1.2
N$54
  Bottom 0.813: T10.2 -24.13,-28.57 R10.1
N$55
  Bottom 0.61: -26.04,-33.66 -27.3,-34.92
  Bottom 0.813: -33.02,-33.66 -33.02,-34.92 | T10.3 -26.04,-33.66 D10.A -27.3,-34.92 -31.75,-34.92 | -31.75,-34.92 -34.29,-34.92 | -34.29,-34.92 K10.16 | -33.02,-33.66 U$7.A | -31.75,-34.92 -33.02,-33.66 | -34.29,-34.92 -33.02,-33.66
N$56
  Bottom 0.813: T11.2 -24.13,-40.01 R11.1
N$57
  Bottom 0.61: -26.04,-45.09 -27.3,-46.35
  Bottom 0.813: -33.02,-45.09 U$6.A | -33.02,-45.09 -33.02,-46.35 | T11.3 -26.04,-45.09 D16.A -27.3,-46.35 -31.75,-46.35 | -31.75,-46.35 -34.29,-46.35 | -34.29,-46.35 K11.16 | -31.75,-46.35 -33.02,-45.09 | -34.29,-46.35 -33.02,-45.09
N$58
  Bottom 0.813: T12.2 -24.13,-51.44 R12.1
N$60
  Bottom 0.61: -26.04,-56.52 -27.3,-57.78
  Bottom 0.813: -33.02,-56.52 -33.02,-57.78 | T12.3 -26.04,-56.52 D15.A -27.3,-57.78 -31.75,-57.78 | -31.75,-57.78 -34.29,-57.78 | -34.29,-57.78 K12.16 | -31.75,-57.78 -33.02,-56.52 | -33.02,-56.52 U$5.A | -34.29,-57.78 -33.02,-56.52
N$61
  Bottom 0.813: T13.2 -24.13,-62.87 R13.1
N$62
  Bottom 0.61: -26.04,-67.94 -27.3,-69.22
  Bottom 0.813: T13.3 -26.04,-67.94 D14.A -27.3,-69.22 -31.75,-69.22 | -31.75,-69.22 -33.02,-69.22 | -33.02,-69.22 -34.29,-69.22 | -34.29,-69.22 K13.16 | -33.02,-69.22 -33.02,-67.94 | -33.02,-67.94 U$4.A | -31.75,-69.22 -33.02,-67.94 | -33.02,-67.94 -34.29,-69.22
N$63
  Bottom 0.813: T14.2 -24.13,-74.3 R14.1
N$64
  Bottom 0.61: -26.04,-79.38 -27.3,-80.64
  Bottom 0.813: -31.75,-80.64 -27.3,-80.64 D13.A -26.04,-79.38 T14.3 | -31.75,-80.64 -33.02,-80.64 | -33.02,-80.64 -34.29,-80.64 | -34.29,-80.64 K14.16 | -33.02,-80.64 -33.02,-79.38 | -33.02,-79.38 U$3.A | -31.75,-80.64 -33.02,-79.38 | -33.02,-79.38 -34.29,-80.64
N$65
  Bottom 0.813: R15.1 -24.13,-85.72 T15.2
N$66
  Bottom 0.61: -26.04,-90.81 -27.3,-92.08
  Bottom 0.813: -33.02,-90.81 U$2.A | -33.02,-90.81 -33.02,-92.08 | T15.3 -26.04,-90.81 D12.A -27.3,-92.08 -31.75,-92.08 | -31.75,-92.08 -34.29,-92.08 | -34.29,-92.08 K15.16 | -31.75,-92.08 -33.02,-90.81 | -34.29,-92.08 -33.02,-90.81
N$67
  Bottom 0.813: T16.2 -24.13,-97.16 R16.1
N$68
  Bottom 0.61: -26.04,-102.23 -27.3,-103.5 | -31.75,-103.5 -33.02,-102.23 -34.29,-103.5
  Bottom 0.813: U$1.A -33.02,-102.23 -33.02,-103.5 | T16.3 -26.04,-102.23 D11.A -27.3,-103.5 -31.75,-103.5 -34.29,-103.5 K16.16
N$69
  Bottom 0.813: IC2.7 3.17,-53.34 2.54,-52.7 2.54,-19.68 -0.64,-16.51 R9.2
N$70
  Bottom 0.813: R10.2 -6.99,-28.57 -2.54,-33.02 IC2.9
N$71
  Bottom 0.813: R11.2 -10.79,-46.35 -6.99,-50.16 -6.99,-51.44 -5.08,-53.34 IC2.10
N$72
  Bottom 0.813: IC2.11 -8.26,-55.88 -10.79,-53.34 R12.2
N$73
  Bottom 0.813: IC2.15 -3.81,-66.04 -6.35,-68.58 -6.35,-92.71 R16.2
N$74
  Bottom 0.813: IC2.14 -4.45,-63.5 -8.26,-67.31 -8.26,-75.56 -10.79,-78.11 R15.2
N$75
  Bottom 0.813: IC2.13 -5.08,-60.96 -10.79,-66.67 R14.2
N$76
  Bottom 0.813: IC2.12 -8.26,-58.42 -10.79,-60.96 R13.2
N$77  (1 unrouted)
N$78
  Bottom 0.813: K9.S1 -62.87,-15.88 -69.22,-22.23 X3.1
N$79
  Bottom 0.813: K9.S2 -62.23,-23.5 -66.04,-27.3 -69.22,-27.3 X3.2
N$80
  Bottom 0.813: X3.3 -65.51,-32.49 -65.41,-32.38 -65.41,-31.11 -61.59,-27.3 K10.S1
N$81
  Bottom 0.813: K10.S2 -62.23,-34.92 -64.77,-37.47 -69.22,-37.47 X3.4
N$82
  Bottom 0.813: K11.S1 -60.96,-38.73 -64.77,-42.55 -69.22,-42.55 X3.5
N$83
  Bottom 0.813: X3.6 -69.22,-47.62 -67.94,-46.35 K11.S2
N$84
  Bottom 0.813: K12.S1 -64.14,-50.16 -66.04,-52.07 -68.58,-52.07 -69.22,-52.7 X3.7
N$85
  Bottom 0.813: X3.8 -61.85,-57.53 -61.59,-57.78 K12.S2
N$86
  Bottom 0.813: K13.S1 -64.14,-61.59 -65.41,-62.87 -68.58,-62.87 -69.22,-63.5 X4.1
N$87
  Bottom 0.813: K13.S2 -64.77,-69.22 -66.04,-67.94 -69.22,-67.94 X4.2
N$88
  Bottom 0.813: X4.3 -69.22,-73.03 K14.S1
N$89
  Bottom 0.813: K14.S2 -61.59,-80.64 -64.14,-78.11 -69.22,-78.11 X4.4
N$90
  Bottom 0.813: K15.S1 -63.5,-84.45 -64.77,-83.19 -69.22,-83.19 X4.5
N$91
  Bottom 0.813: K15.S2 -61.59,-92.08 -65.41,-88.27 -69.22,-88.27 X4.6
N$92
  Bottom 0.813: K16.S1 -62.23,-95.89 -65.41,-92.71 -68.58,-92.71 -69.22,-93.34 X4.7
N$93
  Bottom 0.813: X4.8 -69.22,-98.42 -64.14,-103.5 K16.S2
N$94
  Bottom 0.813: U$14.K -33.02,51.44 -31.75,52.7 R20.1
N$95
  Bottom 0.813: U$15.K -33.02,62.87 -31.75,64.14 R19.1
N$96
  Bottom 0.813: U$1.K -33.02,-97.16 -31.75,-95.89 R32.1
N$98
  Bottom 0.813: U$13.K -33.02,40.01 -31.75,41.27 R17.1
N$108
  Bottom 0.813: K17.1 22.86,-5.08 20.95,-3.17 R33.2
N$109
  Bottom 0.813: -24.77,-29.21 -24.13,-28.57 -20.95,-28.57
N$111
  Bottom 0.813: -24.77,-40.64 -24.13,-40.01 -20.95,-40.01
N$112
  Bottom 0.813: R33.1 U$17.A
N$113
  Bottom 0.813: -24.77,-52.07 -24.13,-51.44 -20.95,-51.44
N$114  (1 unrouted)
N$115
  Bottom 0.813: -24.77,-63.5 -24.13,-62.87 -20.95,-62.87
N$117
  Bottom 0.813: -24.77,-74.93 -24.13,-74.3 -20.95,-74.3
N$118  (1 unrouted)
N$121
  Bottom 0.813: -24.77,-97.79 -24.13,-97.16 -20.95,-97.16
N$133
  Bottom 0.813: -69.22,-32.49 -69.22,-32.38
N$148
  Bottom 0.61: -51.44,-95.25 -50.8,-95.89 | -51.44,-83.19 -50.16,-84.45 -51.44,-85.72 | -51.44,-74.3 -50.16,-73.03 -51.44,-71.75 | -51.44,-62.87 -50.16,-61.59 -51.44,-60.33 | -51.44,-48.9 -50.16,-50.16 -51.44,-51.44 | -51.44,-40.01 -50.16,-38.73 -51.44,-37.47 | -51.44,-3.81 -50.8,-4.45 | -51.44,8.26 -50.16,6.99 -51.44,5.71 | -51.44,17.14 -50.16,18.41 -51.44,19.68 | -51.44,28.57 -50.16,29.84 -51.44,31.11 | -51.44,42.55 -50.16,41.27 -51.44,40.01 | -51.44,51.44 -50.16,52.7 -51.44,53.98
  Bottom 0.813: -51.44,-50.16 -51.44,-48.9 -51.44,-40.01 -51.44,-38.73 | -51.44,-61.59 -51.44,-60.33 -51.44,-51.44 -51.44,-50.16 | -51.44,-61.59 -51.44,-62.87 -51.44,-71.75 -51.44,-73.03 | -51.44,-73.03 -51.44,-74.3 -51.44,-83.19 -51.44,-84.45 | -51.44,-84.45 -51.44,-85.72 -51.44,-95.25 -51.44,-95.89 -50.8,-95.89 K16.P1 | -51.44,-38.73 -51.44,-37.47 -51.44,-28.57 | -51.44,-27.3 -51.44,-28.57 | -51.44,-15.88 -51.44,-17.14 | -51.44,-17.14 -51.44,-26.04 | -51.44,-26.04 -51.44,-27.3 | -51.44,-27.3 -50.16,-27.3 | -50.16,-27.3 K10.P1 | -51.44,-38.73 -50.16,-38.73 K11.P1 | -51.44,-73.03 -50.16,-73.03 K14.P1 | -51.44,-84.45 -50.16,-84.45 K15.P1 | K13.P1 -50.16,-61.59 -51.44,-61.59 | -51.44,-50.16 -50.16,-50.16 K12.P1 | -50.16,-27.3 -51.44,-28.57 | -51.44,-26.04 -50.16,-27.3 | -50.16,-15.88 -51.44,-17.14 | -51.44,41.27 -51.44,42.55 -51.44,51.44 -51.44,52.7 | -51.44,29.84 -51.44,31.11 -51.44,40.01 -51.44,41.27 | -51.44,29.84 -51.44,28.57 -51.44,19.68 -51.44,18.41 | -51.44,18.41 -51.44,17.14 -51.44,8.26 -51.44,6.99 | -51.44,6.99 -51.44,5.71 -51.44,-3.17 | -51.44,-3.17 -51.44,-3.81 -51.44,-4.45 | -51.44,52.7 -51.44,53.98 -51.44,64.14 | -51.44,64.14 -51.44,75.56 | -51.44,-4.45 -50.8,-4.45 -50.16,-4.45 | -50.16,-4.45 K8.P1 | -51.44,64.14 K2.P1 | -51.44,52.7 -50.16,52.7 K3.P1 | -51.44,18.41 -50.16,18.41 K6.P1 | -51.44,6.99 -50.16,6.99 K7.P1 | K5.P1 -50.16,29.84 -51.44,29.84 | -51.44,41.27 -50.16,41.27 K4.P1 | -51.44,-5.71 -51.44,-4.45 | -51.44,-5.71 -51.44,-14.61 | -51.44,-14.61 -51.44,-15.88 | -51.44,-15.88 -51.44,-17.78 | -51.44,-15.88 -50.16,-15.88 | -50.16,-15.88 K9.P1 | -51.44,-14.61 -50.16,-15.88 | -50.16,-4.45 -51.44,-5.71 | -51.44,-3.17 -50.16,-4.45
  Bottom 0.813: -51.44,75.56 K1.P1 | -51.44,75.56 -51.44,78.74 -47.62,82.55 | -47.62,82.55 -45.72,84.45 | X5.2 -43.23,86.94 -47.62,82.55
N$150
  Bottom 0.813: U$12.K -33.02,28.57 -31.75,29.84 R21.1
N$153
  Bottom 0.813: U$11.K -33.02,17.14 -31.75,18.41 R22.1
N$156
  Bottom 0.813: U$10.K -33.02,5.71 -31.75,6.99 R23.1
N$160
  Bottom 0.813: U$9.K -33.02,-5.71 -31.75,-4.45 R24.1
N$163
  Bottom 0.813: U$8.K -33.02,-17.14 -31.75,-15.88 R25.1
N$165
  Bottom 0.813: U$7.K -33.02,-28.57 -31.75,-27.3 R26.1
N$169
  Bottom 0.813: U$6.K -33.02,-40.01 -31.75,-38.73 R27.1
N$171
  Bottom 0.813: U$5.K -33.02,-51.44 -31.75,-50.16 R28.1
N$174
  Bottom 0.813: U$4.K -33.02,-62.87 -31.75,-61.59 R29.1
N$177
  Bottom 0.813: U$3.K -33.02,-74.3 -31.75,-73.03 R30.1
N$180
  Bottom 0.813: U$2.K -33.02,-85.72 -31.75,-84.45 R31.1
N$14823
  Bottom 0.61: -46.35,-102.23 -47.62,-103.5 | -46.35,-91.44 -46.99,-92.08 -46.35,-92.71 | -46.35,-81.92 -47.62,-80.64 -46.35,-79.38 | -46.35,-67.94 -47.62,-69.22 -46.35,-70.48 | -46.35,-59.05 -47.62,-57.78 -46.35,-56.52 | -46.35,-47.62 -47.62,-46.35 -46.35,-45.09 | -47.62,-23.5 -46.35,-24.77
  Bottom 0.813: -46.35,-80.64 -47.62,-80.64 K14.P2 | -46.35,-80.64 -46.35,-81.92 -46.35,-91.44 -46.35,-92.08 | -46.35,-92.08 -46.99,-92.08 K15.P2 | -46.35,-92.08 -46.35,-92.71 -46.35,-102.23 -46.35,-103.5 -47.62,-103.5 K16.P2 | -46.35,-69.22 -47.62,-69.22 K13.P2 | -46.35,-69.22 -46.35,-70.48 -46.35,-79.38 -46.35,-80.64 | K12.P2 -47.62,-57.78 -46.35,-57.78 | -46.35,-57.78 -46.35,-59.05 -46.35,-67.94 -46.35,-69.22 | -46.35,-46.35 -47.62,-46.35 K11.P2 | -46.35,-57.78 -46.35,-56.52 -46.35,-47.62 -46.35,-46.35 | -46.35,-34.92 K10.P2 | -46.35,-46.35 -46.35,-45.09 -46.35,-34.92 | -46.35,-34.92 -46.35,-24.77 -46.35,-23.5 | -46.35,-23.5 -47.62,-23.5 | -47.62,-23.5 K9.P2 | -46.35,-22.23 -46.35,-23.5 | -46.35,-12.06 -47.62,-12.06 | -47.62,-12.06 K8.P2 | -46.35,45.09 -46.35,52.7 | -46.35,45.09 -46.35,33.66 | -46.35,33.66 -46.35,22.23 | -46.35,22.23 -46.35,10.79 | -46.35,10.79 -46.35,-0.64 | -46.35,-0.64 -46.35,-10.79 | -46.35,-10.79 -46.35,-12.06 | -46.35,52.7 -46.35,53.98 | -46.35,-22.23 -47.62,-23.5 | -46.35,-12.06 -46.35,-13.34 | -46.35,-13.34 -46.35,-22.23 | -47.62,-12.06 -46.35,-13.34 | -46.35,-10.79 -47.62,-12.06 | -46.35,-0.64 K7.P2 | -46.35,10.79 K6.P2 | -46.35,22.23 K5.P2 | -46.35,33.66 K4.P2 | -46.35,45.09 K3.P2 | -46.35,52.7 -46.35,55.88 | -46.35,55.88 -46.35,67.94 | K2.P2 -46.99,56.52 -46.35,55.88 | -46.35,67.94 K1.P2 | -46.35,67.94 -46.35,77.47 -41.91,81.92 -41.91,81.94 X5.1
PB0
  Bottom 0.813: BUS.2 IC7.2
PB1
  Bottom 0.813: BUS.4 IC7.3
PB2
  Bottom 0.813: BUS.6 IC7.4
PB3
  Bottom 0.813: BUS.8 IC7.5
PB4
  Bottom 0.813: BUS.10 IC7.6
PB5
  Bottom 0.813: BUS.12 IC7.7
PB6
  Bottom 0.813: BUS.14 IC7.8
PB7
  Bottom 0.813: IC7.9 27.3,-48.9 27.94,-49.53 38.1,-49.53 BUS.16
PE  (via drill 1.02)  (2 unrouted)
  Bottom 0.61: -43.81,-94.61 -42.55,-95.89 -43.81,-97.16 | -43.81,-85.72 -42.55,-84.45 -43.81,-83.19 | -43.81,-74.3 -42.55,-73.03 -43.81,-71.75 | -43.81,-62.87 -42.55,-61.59 -43.81,-60.33 | -43.81,-51.44 -42.55,-50.16 -43.81,-48.9 | -43.81,-40.01 -42.55,-38.73 -43.81,-37.47 | -43.81,-28.57 -42.55,-27.3 -43.81,-26.04 | -42.55,-15.88 -43.81,-17.14 | BUS.15 40.01,-47.62 28.57,-47.62 27.3,-46.35 IC7.10
  Bottom 0.813: -42.55,-15.88 -43.81,-15.88 -43.81,-17.14 -43.81,-26.04 -43.81,-27.3 | -42.55,-15.88 K9.1 R25.2 | -43.81,-27.3 -42.55,-27.3 K10.1 R26.2 | -43.81,-38.73 -42.55,-38.73 K11.1 R27.2 | -43.81,-38.73 -43.81,-37.47 -43.81,-28.57 -43.81,-27.3 | -43.81,-50.16 -42.55,-50.16 K12.1 R28.2 | -43.81,-50.16 -43.81,-48.9 -43.81,-40.01 -43.81,-38.73 | -43.81,-61.59 -42.55,-61.59 K13.1 R29.2 | -43.81,-61.59 -43.81,-60.33 -43.81,-51.44 -43.81,-50.16 | -43.81,-73.03 -42.55,-73.03 K14.1 R30.2 | -43.81,-61.59 -43.81,-62.87 -43.81,-71.75 -43.81,-73.03 | -43.81,-84.45 -42.55,-84.45 K15.1 R31.2 | -43.81,-73.03 -43.81,-74.3 -43.81,-83.19 -43.81,-84.45 | -43.81,-95.89 -42.55,-95.89 K16.1 R32.2 | -43.81,-84.45 -43.81,-85.72 -43.81,-94.61 -43.81,-95.89 | -43.81,-95.89 -43.81,-97.16 -43.81,-105.41 -42.55,-106.68 12.06,-106.68 34.92,-83.82 | 41.27,-52.7 BUS.11 42.55,-53.98 | 41.27,-52.7 BUS.13 BUS.15 | 42.55,-53.98 44.45,-53.98 46.35,-55.88 46.35,-71.75 38.1,-80.64 36.2,-82.55 | 42.55,-53.98 41.27,-52.7 | -42.55,75.56 -43.81,75.56 -43.81,74.3 | -42.55,75.56 K1.1 R18.2 | -43.81,64.14 -43.81,65.41 | -43.81,65.41 -43.81,74.3 | -43.81,52.7 -43.81,53.98 | -43.81,53.98 -43.81,62.87 | -43.81,62.87 -43.81,64.14 | -43.81,41.27 -43.81,42.55 | -43.81,42.55 -43.81,51.44 | -43.81,51.44 -43.81,52.7 | -43.81,31.11 -43.81,29.84 | -43.81,40.01 -43.81,31.11 | -43.81,41.27 -43.81,40.01 | -43.81,29.84 -43.81,28.57 | -43.81,28.57 -43.81,19.68 | -43.81,19.68 -43.81,18.41 | -43.81,18.41 -43.81,17.14 | -43.81,17.14 -43.81,8.26 | -43.81,8.26 -43.81,6.99 | -43.81,6.99 -43.81,5.71 | -43.81,5.71 -43.81,-3.17 | -43.81,-3.17 -43.81,-4.45 | -43.81,64.14 -42.55,64.14
  Bottom 0.813: -42.55,64.14 K2.1 R19.2 | -43.81,52.7 -42.55,52.7 | -42.55,52.7 K3.1 R20.2 | -42.55,41.27 -43.81,41.27 | -42.55,41.27 K4.1 R17.2 | -43.81,29.84 -42.55,29.84 | -42.55,29.84 K5.1 R21.2 | -43.81,18.41 -42.55,18.41 | -42.55,18.41 K6.1 R22.2 | -43.81,6.99 -42.55,6.99 | -42.55,6.99 K7.1 R23.2 | -43.81,-4.45 -42.55,-4.45 | -42.55,-4.45 K8.1 R24.2 | -43.81,-4.45 -43.81,-5.71 | -43.81,-5.71 -43.81,-14.61 | -43.81,-14.61 -43.81,-16.51 | -43.81,-14.61 -42.55,-15.88 | -42.55,6.99 -43.81,5.71 | -43.81,8.26 -42.55,6.99 | -42.55,-4.45 -43.81,-5.71 | -43.81,-3.17 -42.55,-4.45 | -42.55,18.41 -43.81,17.14 | -43.81,19.68 -42.55,18.41 | -42.55,29.84 -43.81,28.57 | -43.81,31.11 -42.55,29.84 | -42.55,41.27 -43.81,40.01 | -42.55,41.27 -43.81,42.55 | -43.81,51.44 -42.55,52.7 | -42.55,52.7 -43.81,53.98 | -43.81,62.87 -42.55,64.14 | -42.55,64.14 -43.81,65.41 | -43.81,74.3 -42.55,75.56 | v2.54,-81.28 IC1.7 2.54,-87.63 3.81,-88.9 17.14,-88.9 26.04,-80.01 IC7.1 28.57,-69.22 33.02,-73.66 IC8.2 33.02,-80.64 34.92,-82.55 | 34.92,-83.82 35.56,-83.19 | 35.56,-83.19 36.2,-82.55 | 35.56,-83.19 34.92,-82.55 | 34.92,-82.55 36.2,-82.55 | 34.92,-83.82 34.92,-82.55 | 34.92,19.05 33.66,19.05 | 33.66,19.05 T17.E | K17.P2 34.92,17.78 | 34.92,17.78 34.92,19.05 | 34.92,19.05 35.56,19.05 | 36.2,19.05 40.01,19.05 41.27,20.32 41.27,39.37 40.01,40.64 V1.7 35.56,40.64 33.02,43.18 7.62,43.18 IC3.8 | 34.92,17.78 34.92,18.41 35.56,19.05 | 36.2,19.05 35.56,19.05 | 34.92,17.78 36.2,19.05 | 34.92,17.78 33.66,19.05
(copper drawn outside any net)
  shapes: Bottom circle x8

### Text on the board
Bottom: 0 | 1 | 2 | 3 | 4 | 5 | 6 | 7